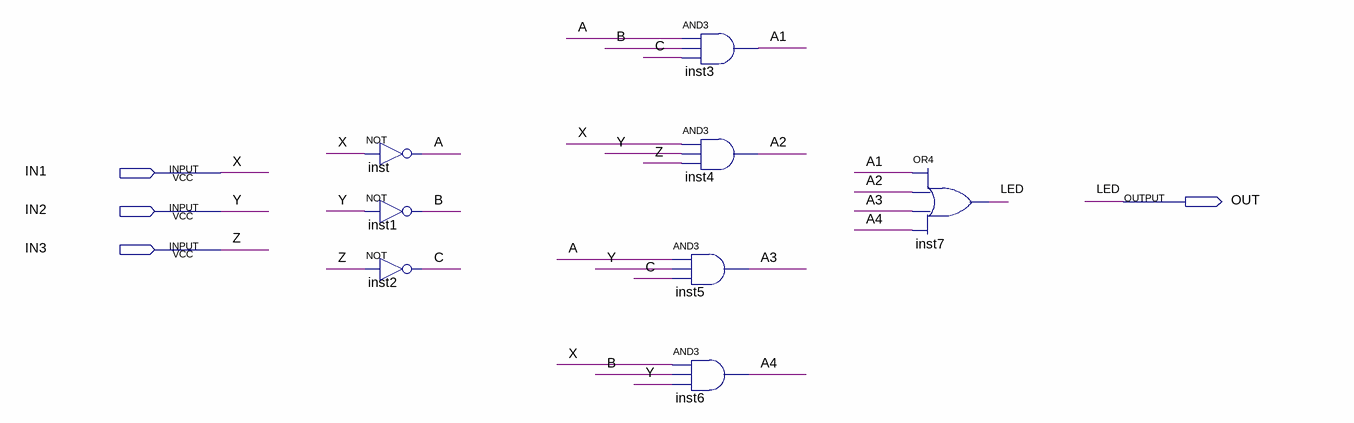
[diagram p0: schematic sheet]
// Quartus schematic name_tag.bdf as structural Verilog: 8 symbols, 4 pins
module name_tag (
  input  IN1,
  input  IN2,
  input  IN3,
  output OUT
);

  wire A, A1, A2, A3, A4, B, C;

  not inst (A, IN1);
  not inst1 (B, IN2);
  not inst2 (C, IN3);
  and inst3 (A1, A, B, C);
  and inst4 (A2, IN1, IN2, IN3);
  and inst5 (A3, A, IN2, C);
  and inst6 (A4, IN1, B, IN2);
  or inst7 (OUT, A1, A2, A3, A4);

  // Other names for the same wires on the sheet: LED = OUT; X = IN1; Y = IN2; Z = IN3
endmodule
